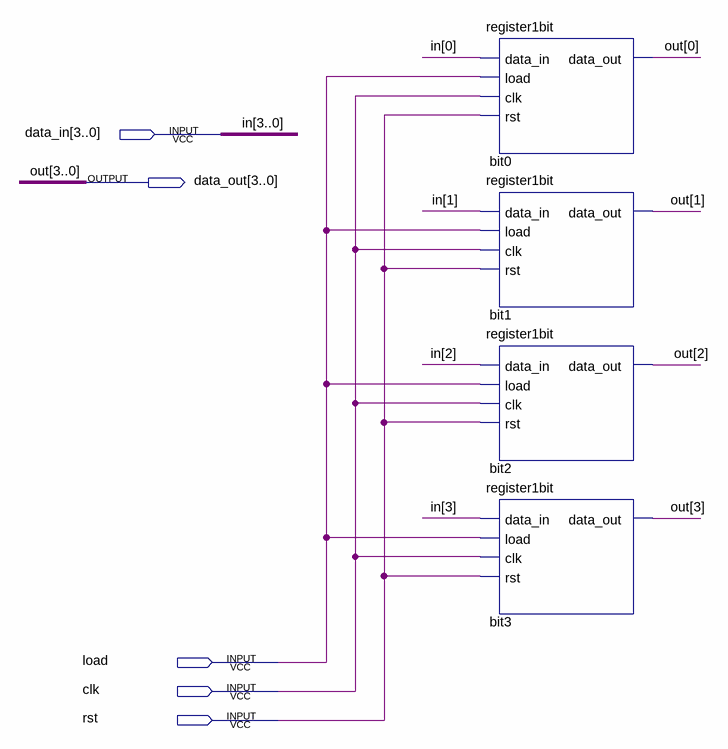
[diagram p0: schematic sheet]
// Quartus schematic register4bit.bdf as structural Verilog: 4 symbols, 5 pins
module register4bit (
  input  [3:0] data_in,
  input  load,
  input  clk,
  input  rst,
  output [3:0] data_out
);

  register1bit bit0 (.data_in(data_in[0]), .load(load), .clk(clk), .rst(rst), .data_out(data_out[0]));
  register1bit bit1 (.data_in(data_in[1]), .load(load), .clk(clk), .rst(rst), .data_out(data_out[1]));
  register1bit bit2 (.data_in(data_in[2]), .load(load), .clk(clk), .rst(rst), .data_out(data_out[2]));
  register1bit bit3 (.data_in(data_in[3]), .load(load), .clk(clk), .rst(rst), .data_out(data_out[3]));

  // Other names for the same wires on the sheet: in[3:0] = data_in; out[3:0] = data_out
endmodule
